# Altium schematic sheet A7_POWER.SchDoc
size A3
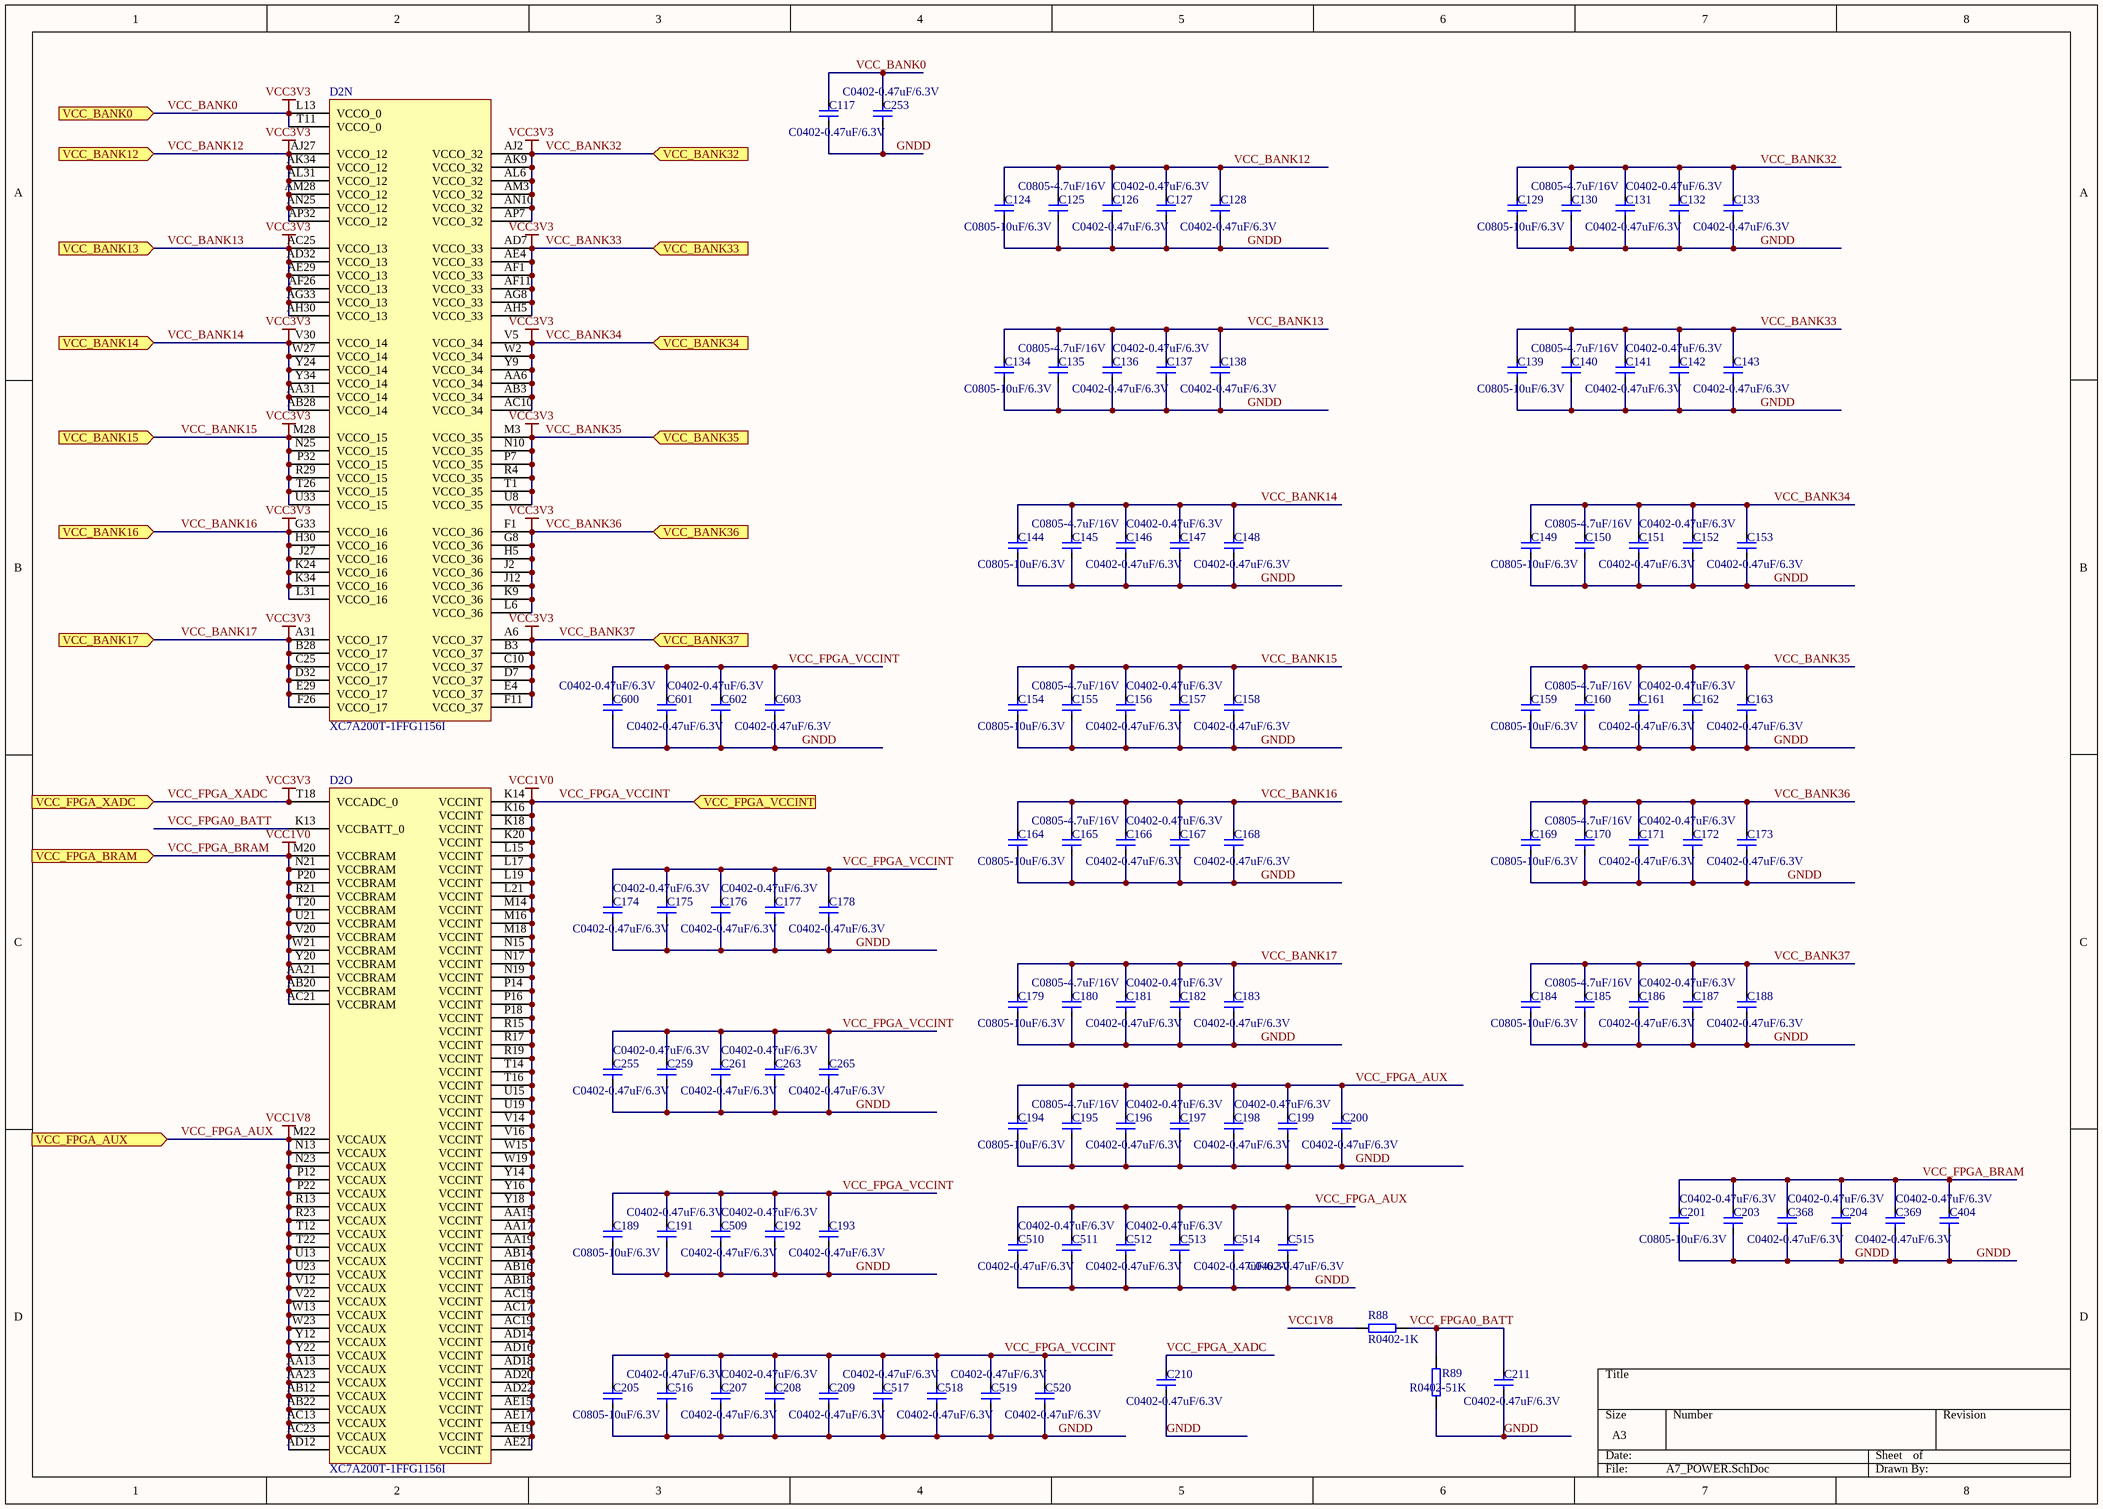
[diagram p0: A7_POWER.SchDoc]

## Parts
C117  C0402-0.47uF/6.3V  [C0402]
C124  C0805-10uF/6.3V  [C0805]
C125  C0805-4.7uF/16V  [C0805]
C126  C0402-0.47uF/6.3V  [C0402]
C127  C0402-0.47uF/6.3V  [C0402]
C128  C0402-0.47uF/6.3V  [C0402]
C129  C0805-10uF/6.3V  [C0805]
C130  C0805-4.7uF/16V  [C0805]
C131  C0402-0.47uF/6.3V  [C0402]
C132  C0402-0.47uF/6.3V  [C0402]
C133  C0402-0.47uF/6.3V  [C0402]
C134  C0805-10uF/6.3V  [C0805]
C135  C0805-4.7uF/16V  [C0805]
C136  C0402-0.47uF/6.3V  [C0402]
C137  C0402-0.47uF/6.3V  [C0402]
C138  C0402-0.47uF/6.3V  [C0402]
C139  C0805-10uF/6.3V  [C0805]
C140  C0805-4.7uF/16V  [C0805]
C141  C0402-0.47uF/6.3V  [C0402]
C142  C0402-0.47uF/6.3V  [C0402]
C143  C0402-0.47uF/6.3V  [C0402]
C144  C0805-10uF/6.3V  [C0805]
C145  C0805-4.7uF/16V  [C0805]
C146  C0402-0.47uF/6.3V  [C0402]
C147  C0402-0.47uF/6.3V  [C0402]
C148  C0402-0.47uF/6.3V  [C0402]
C149  C0805-10uF/6.3V  [C0805]
C150  C0805-4.7uF/16V  [C0805]
C151  C0402-0.47uF/6.3V  [C0402]
C152  C0402-0.47uF/6.3V  [C0402]
C153  C0402-0.47uF/6.3V  [C0402]
C154  C0805-10uF/6.3V  [C0805]
C155  C0805-4.7uF/16V  [C0805]
C156  C0402-0.47uF/6.3V  [C0402]
C157  C0402-0.47uF/6.3V  [C0402]
C158  C0402-0.47uF/6.3V  [C0402]
C159  C0805-10uF/6.3V  [C0805]
C160  C0805-4.7uF/16V  [C0805]
C161  C0402-0.47uF/6.3V  [C0402]
C162  C0402-0.47uF/6.3V  [C0402]
C163  C0402-0.47uF/6.3V  [C0402]
C164  C0805-10uF/6.3V  [C0805]
C165  C0805-4.7uF/16V  [C0805]
C166  C0402-0.47uF/6.3V  [C0402]
C167  C0402-0.47uF/6.3V  [C0402]
C168  C0402-0.47uF/6.3V  [C0402]
C169  C0805-10uF/6.3V  [C0805]
C170  C0805-4.7uF/16V  [C0805]
C171  C0402-0.47uF/6.3V  [C0402]
C172  C0402-0.47uF/6.3V  [C0402]
C173  C0402-0.47uF/6.3V  [C0402]
C174  C0402-0.47uF/6.3V  [C0402]
C175  C0402-0.47uF/6.3V  [C0402]
C176  C0402-0.47uF/6.3V  [C0402]
C177  C0402-0.47uF/6.3V  [C0402]
C178  C0402-0.47uF/6.3V  [C0402]
C179  C0805-10uF/6.3V  [C0805]
C180  C0805-4.7uF/16V  [C0805]
C181  C0402-0.47uF/6.3V  [C0402]
C182  C0402-0.47uF/6.3V  [C0402]
C183  C0402-0.47uF/6.3V  [C0402]
C184  C0805-10uF/6.3V  [C0805]
C185  C0805-4.7uF/16V  [C0805]
C186  C0402-0.47uF/6.3V  [C0402]
C187  C0402-0.47uF/6.3V  [C0402]
C188  C0402-0.47uF/6.3V  [C0402]
C189  C0805-10uF/6.3V  [C0805]
C191  C0402-0.47uF/6.3V  [C0402]
C192  C0402-0.47uF/6.3V  [C0402]
C193  C0402-0.47uF/6.3V  [C0402]
C194  C0805-10uF/6.3V  [C0805]
C195  C0805-4.7uF/16V  [C0805]
C196  C0402-0.47uF/6.3V  [C0402]
C197  C0402-0.47uF/6.3V  [C0402]
C198  C0402-0.47uF/6.3V  [C0402]
C199  C0402-0.47uF/6.3V  [C0402]
C200  C0402-0.47uF/6.3V  [C0402]
C201  C0805-10uF/6.3V  [C0805]
C203  C0402-0.47uF/6.3V  [C0402]
C204  C0402-0.47uF/6.3V  [C0402]
C205  C0805-10uF/6.3V  [C0805]
C207  C0402-0.47uF/6.3V  [C0402]
C208  C0402-0.47uF/6.3V  [C0402]
C209  C0402-0.47uF/6.3V  [C0402]
C210  C0402-0.47uF/6.3V  [C0402]
C211  C0402-0.47uF/6.3V  [C0402]
C253  C0402-0.47uF/6.3V  [C0402]
C255  C0402-0.47uF/6.3V  [C0402]
C259  C0402-0.47uF/6.3V  [C0402]
C261  C0402-0.47uF/6.3V  [C0402]
C263  C0402-0.47uF/6.3V  [C0402]
C265  C0402-0.47uF/6.3V  [C0402]
C368  C0402-0.47uF/6.3V  [C0402]
C369  C0402-0.47uF/6.3V  [C0402]
C404  C0402-0.47uF/6.3V  [C0402]
C509  C0402-0.47uF/6.3V  [C0402]
C510  C0402-0.47uF/6.3V  [C0402]
C511  C0402-0.47uF/6.3V  [C0402]
C512  C0402-0.47uF/6.3V  [C0402]
C513  C0402-0.47uF/6.3V  [C0402]
C514  C0402-0.47uF/6.3V  [C0402]
C515  C0402-0.47uF/6.3V  [C0402]
C516  C0402-0.47uF/6.3V  [C0402]
C517  C0402-0.47uF/6.3V  [C0402]
C518  C0402-0.47uF/6.3V  [C0402]
C519  C0402-0.47uF/6.3V  [C0402]
C520  C0402-0.47uF/6.3V  [C0402]
C600  C0402-0.47uF/6.3V  [C0402]
C601  C0402-0.47uF/6.3V  [C0402]
C602  C0402-0.47uF/6.3V  [C0402]
C603  C0402-0.47uF/6.3V  [C0402]
D2  XC7A200T-1FFG1156I  [FFG1156]  (parts N,O of 18)
R88  R0402-1K  [R0402]
R89  R0402-51K  [R0402]

## Ports
VCC_BANK0 (in), VCC_BANK12 (in), VCC_BANK13 (in), VCC_BANK14 (in), VCC_BANK15 (in), VCC_BANK16 (in), VCC_BANK17 (in), VCC_BANK32 (in), VCC_BANK33 (in), VCC_BANK34 (in), VCC_BANK35 (in), VCC_BANK36 (in), VCC_BANK37 (in), VCC_FPGA_AUX (in), VCC_FPGA_BRAM (in), VCC_FPGA_VCCINT (in), VCC_FPGA_XADC (in)

## Nets
VCC1V8: C194.1 C195.1 C196.1 C197.1 C198.1 C199.1 C200.1 C510.1 C511.1 C512.1 C513.1 C514.1 C515.1 D2.AA13(VCCAUX) D2.AA23(VCCAUX) D2.AB12(VCCAUX) D2.AB22(VCCAUX) D2.AC13(VCCAUX) D2.AC23(VCCAUX) D2.AD12(VCCAUX) D2.M22(VCCAUX) D2.N13(VCCAUX) D2.N23(VCCAUX) D2.P12(VCCAUX) D2.P22(VCCAUX) D2.R13(VCCAUX) D2.R23(VCCAUX) D2.T12(VCCAUX) D2.T22(VCCAUX) D2.U13(VCCAUX) D2.U23(VCCAUX) D2.V12(VCCAUX) D2.V22(VCCAUX) D2.W13(VCCAUX) D2.W23(VCCAUX) D2.Y12(VCCAUX) D2.Y22(VCCAUX) R88.2 ; port VCC_FPGA_AUX  [also labelled VCC_FPGA_AUX]
VCC_BANK0: C117.1 C124.1 C125.1 C126.1 C127.1 C128.1 C129.1 C130.1 C131.1 C132.1 C133.1 C134.1 C135.1 C136.1 C137.1 C138.1 C139.1 C140.1 C141.1 C142.1 C143.1 C144.1 C145.1 C146.1 C147.1 C148.1 C149.1 C150.1 C151.1 C152.1 C153.1 C154.1 C155.1 C156.1 C157.1 C158.1 C159.1 C160.1 C161.1 C162.1 C163.1 C164.1 C165.1 C166.1 C167.1 C168.1 C169.1 C170.1 C171.1 C172.1 C173.1 C179.1 C180.1 C181.1 C182.1 C183.1 C184.1 C185.1 C186.1 C187.1 C188.1 C210.1 C253.1 D2.A6(VCCO_37) D2.A31(VCCO_17) D2.AA6(VCCO_34) D2.AA31(VCCO_14) D2.AB3(VCCO_34) D2.AB28(VCCO_14) D2.AC10(VCCO_34) D2.AC25(VCCO_13) D2.AD7(VCCO_33) D2.AD32(VCCO_13) D2.AE4(VCCO_33) D2.AE29(VCCO_13) D2.AF1(VCCO_33) D2.AF11(VCCO_33) D2.AF26(VCCO_13) D2.AG8(VCCO_33) D2.AG33(VCCO_13) D2.AH5(VCCO_33) D2.AH30(VCCO_13) D2.AJ2(VCCO_32) D2.AJ27(VCCO_12) D2.AK9(VCCO_32) D2.AK34(VCCO_12) D2.AL6(VCCO_32) D2.AL31(VCCO_12) D2.AM3(VCCO_32) D2.AM28(VCCO_12) D2.AN10(VCCO_32) D2.AN25(VCCO_12) D2.AP7(VCCO_32) D2.AP32(VCCO_12) D2.B3(VCCO_37) D2.B28(VCCO_17) D2.C10(VCCO_37) D2.C25(VCCO_17) D2.D7(VCCO_37) D2.D32(VCCO_17) D2.E4(VCCO_37) D2.E29(VCCO_17) D2.F1(VCCO_36) D2.F11(VCCO_37) D2.F26(VCCO_17) D2.G8(VCCO_36) D2.G33(VCCO_16) D2.H5(VCCO_36) D2.H30(VCCO_16) D2.J2(VCCO_36) D2.J12(VCCO_36) D2.J27(VCCO_16) D2.K9(VCCO_36) D2.K24(VCCO_16) D2.K34(VCCO_16) D2.L6(VCCO_36) D2.L13(VCCO_0) D2.L31(VCCO_16) D2.M3(VCCO_35) D2.M28(VCCO_15) D2.N10(VCCO_35) D2.N25(VCCO_15) D2.P7(VCCO_35) D2.P32(VCCO_15) D2.R4(VCCO_35) D2.R29(VCCO_15) D2.T1(VCCO_35) D2.T11(VCCO_0) D2.T18(VCCADC_0) D2.T26(VCCO_15) D2.U8(VCCO_35) D2.U33(VCCO_15) D2.V5(VCCO_34) D2.V30(VCCO_14) D2.W2(VCCO_34) D2.W27(VCCO_14) D2.Y9(VCCO_34) D2.Y24(VCCO_14) D2.Y34(VCCO_14) ; port VCC_BANK0, port VCC_FPGA_XADC, port VCC_BANK12, port VCC_BANK13, port VCC_BANK14, port VCC_BANK15, port VCC_BANK16, port VCC_BANK17, port VCC_BANK32, port VCC_BANK33, port VCC_BANK34, port VCC_BANK35, port VCC_BANK36, port VCC_BANK37  [also labelled VCC3V3, VCC_BANK12, VCC_BANK13, VCC_BANK14, VCC_BANK15, VCC_BANK16, VCC_BANK17, VCC_BANK32, VCC_BANK33, VCC_BANK34, VCC_BANK35, VCC_BANK36, VCC_BANK37, VCC_FPGA_XADC]
VCC_FPGA_BRAM: C174.1 C175.1 C176.1 C177.1 C178.1 C189.1 C191.1 C192.1 C193.1 C201.1 C203.1 C204.1 C205.1 C207.1 C208.1 C209.1 C255.1 C259.1 C261.1 C263.1 C265.1 C368.1 C369.1 C404.1 C509.1 C516.1 C517.1 C518.1 C519.1 C520.1 C600.1 C601.1 C602.1 C603.1 D2.AA15(VCCINT) D2.AA17(VCCINT) D2.AA19(VCCINT) D2.AA21(VCCBRAM) D2.AB14(VCCINT) D2.AB16(VCCINT) D2.AB18(VCCINT) D2.AB20(VCCBRAM) D2.AC15(VCCINT) D2.AC17(VCCINT) D2.AC19(VCCINT) D2.AC21(VCCBRAM) D2.AD14(VCCINT) D2.AD16(VCCINT) D2.AD18(VCCINT) D2.AD20(VCCINT) D2.AD22(VCCINT) D2.AE15(VCCINT) D2.AE17(VCCINT) D2.AE19(VCCINT) D2.AE21(VCCINT) D2.K14(VCCINT) D2.K16(VCCINT) D2.K18(VCCINT) D2.K20(VCCINT) D2.L15(VCCINT) D2.L17(VCCINT) D2.L19(VCCINT) D2.L21(VCCINT) D2.M14(VCCINT) D2.M16(VCCINT) D2.M18(VCCINT) D2.M20(VCCBRAM) D2.N15(VCCINT) D2.N17(VCCINT) D2.N19(VCCINT) D2.N21(VCCBRAM) D2.P14(VCCINT) D2.P16(VCCINT) D2.P18(VCCINT) D2.P20(VCCBRAM) D2.R15(VCCINT) D2.R17(VCCINT) D2.R19(VCCINT) D2.R21(VCCBRAM) D2.T14(VCCINT) D2.T16(VCCINT) D2.T20(VCCBRAM) D2.U15(VCCINT) D2.U19(VCCINT) D2.U21(VCCBRAM) D2.V14(VCCINT) D2.V16(VCCINT) D2.V20(VCCBRAM) D2.W15(VCCINT) D2.W19(VCCINT) D2.W21(VCCBRAM) D2.Y14(VCCINT) D2.Y16(VCCINT) D2.Y18(VCCINT) D2.Y20(VCCBRAM) ; port VCC_FPGA_BRAM, port VCC_FPGA_VCCINT  [also labelled VCC1V0, VCC_FPGA_VCCINT]
GNDD: C117.2 C124.2 C125.2 C126.2 C127.2 C128.2 C129.2 C130.2 C131.2 C132.2 C133.2 C134.2 C135.2 C136.2 C137.2 C138.2 C139.2 C140.2 C141.2 C142.2 C143.2 C144.2 C145.2 C146.2 C147.2 C148.2 C149.2 C150.2 C151.2 C152.2 C153.2 C154.2 C155.2 C156.2 C157.2 C158.2 C159.2 C160.2 C161.2 C162.2 C163.2 C164.2 C165.2 C166.2 C167.2 C168.2 C169.2 C170.2 C171.2 C172.2 C173.2 C174.2 C175.2 C176.2 C177.2 C178.2 C179.2 C180.2 C181.2 C182.2 C183.2 C184.2 C185.2 C186.2 C187.2 C188.2 C189.2 C191.2 C192.2 C193.2 C194.2 C195.2 C196.2 C197.2 C198.2 C199.2 C200.2 C201.2 C203.2 C204.2 C205.2 C207.2 C208.2 C209.2 C210.2 C211.2 C253.2 C255.2 C259.2 C261.2 C263.2 C265.2 C368.2 C369.2 C404.2 C509.2 C510.2 C511.2 C512.2 C513.2 C514.2 C515.2 C516.2 C517.2 C518.2 C519.2 C520.2 C600.2 C601.2 C602.2 C603.2 R89.1
VCC_FPGA0_BATT: C211.1 D2.K13(VCCBATT_0) R88.1 R89.2

## Library data of the parts
C117 C126-C128 C131-C133 C136-C138 C141-C143 C146-C148 C151-C153 C156-C158 C161-C163 C166-C168 C171-C178 C181-C183 C186-C188 C191-C193 C196-C200 C203 C204 C207-C211 C253 C255 C259 C261 C263 C265 C368 C369 C404 C509-C520 C600-C603 = C0402-0.1uF/16V: X7R; Manufacturer: SAMSUNG; Manufacturer_p/n: CL05X7R104KO5NNN; Part_number: C0402-0.47uF/6.3V; Part_type: CAP; Value: C0402-0.47uF/6.3V; temperature: -55℃\+125℃; Schematic_Part: CAP; PCB_Footprint: C0402; datasheet: #DataSheet\C_Samsung_General Capacitors.pdf#
C124 C129 C134 C139 C144 C149 C154 C159 C164 C169 C179 C184 C189 C194 C201 C205 = C1210-22uF/16V: Part_number: C0805-10uF/6.3V; Part_type: CAP; Value: C0805-10uF/6.3V; Schematic_Part: CAP; PCB_Footprint: C0805
C125 C130 C135 C140 C145 C150 C155 C160 C165 C170 C180 C185 C195 = C0805-4.7uF/50V: X7R; Manufacturer: SAMSUNG; Part_number: C0805-4.7uF/16V; Part_type: CAP; Value: C0805-4.7uF/16V; Schematic_Part: CAP; PCB_Footprint: C0805; datasheet: #DataSheet\C_Samsung_General Capacitors.pdf#
D2 = XC7A200T-1FFG1156I: Artix-7 FPGA, 500 User I/Os, 16 GTP, 1156-Ball BGA, Speed Grade 1, Industrial Grade, Pb-Free; Manufacturer: Xilinx; Block RAM Blocks (18Kb): 730; Block RAM Blocks (36Kb): 365; Block RAM Blocks (Max Kb): 13140; CLBs (Slices): 33650; Clock Mgmt Tiles (CMTs): 10; DSP48E1 Slices: 740; Logic Cells: 215360; Max User I/O: 500; Speed Grade: -1; DatasheetVersion: v1.12; PackageVersion: Rev 1.8; PackageReference: FFG1156; PackageDescription: Flip-Chip BGA, Body 35 x 35 mm, 1.0 mm Pitch; CLBs (Max Distributed RAM Kb): 2888; Generic Part Number: XC7A200T; RoHS: Pb-Free; Mounting Technology: Surface Mount; Code_JEDEC: MS-034-AAR-1; PartNumber: XC7A200T-1FFG1156I; ComponentLink1Description: Datasheet; ComponentLink1URL: http://www.xilinx.com/support/documentation/data_sheets/ds180_7Series_Overview.pdf; ComponentLink2Description: Package Specification; ComponentLink2URL: http://www.xilinx.com/support/documentation/user_guides/ug475_7Series_Pkg_Pinout.pdf; ComponentLink3Description: DC and Switching Characteristics; ComponentLink3URL: http://www.xilinx.com/support/documentation/data_sheets/ds181_Artix_7_Data_Sheet.pdf; ComponentLink4Description: Package File; ComponentLink4URL: http://www.xilinx.com/support/packagefiles/a7packages/xc7a200tfbg676pkg.txt; ComponentLink5Description: Packaging and Pinout; ComponentLink5URL: http://www.xilinx.com/support/documentation/user_guides/ug475_7Series_Pkg_Pinout.pdf
R88 R89 = R0402-10K: Manufacturer: SAMSUNG; Part_type: RES; Schematic_Part: RES; PCB_Footprint: R0402
  R88: Part_number: R0402-1K; Value: R0402-1K
  R89: Part_number: R0402-51K; Value: R0402-51K